# EAGLE design Pre_sch (EAGLE 9.6.2)
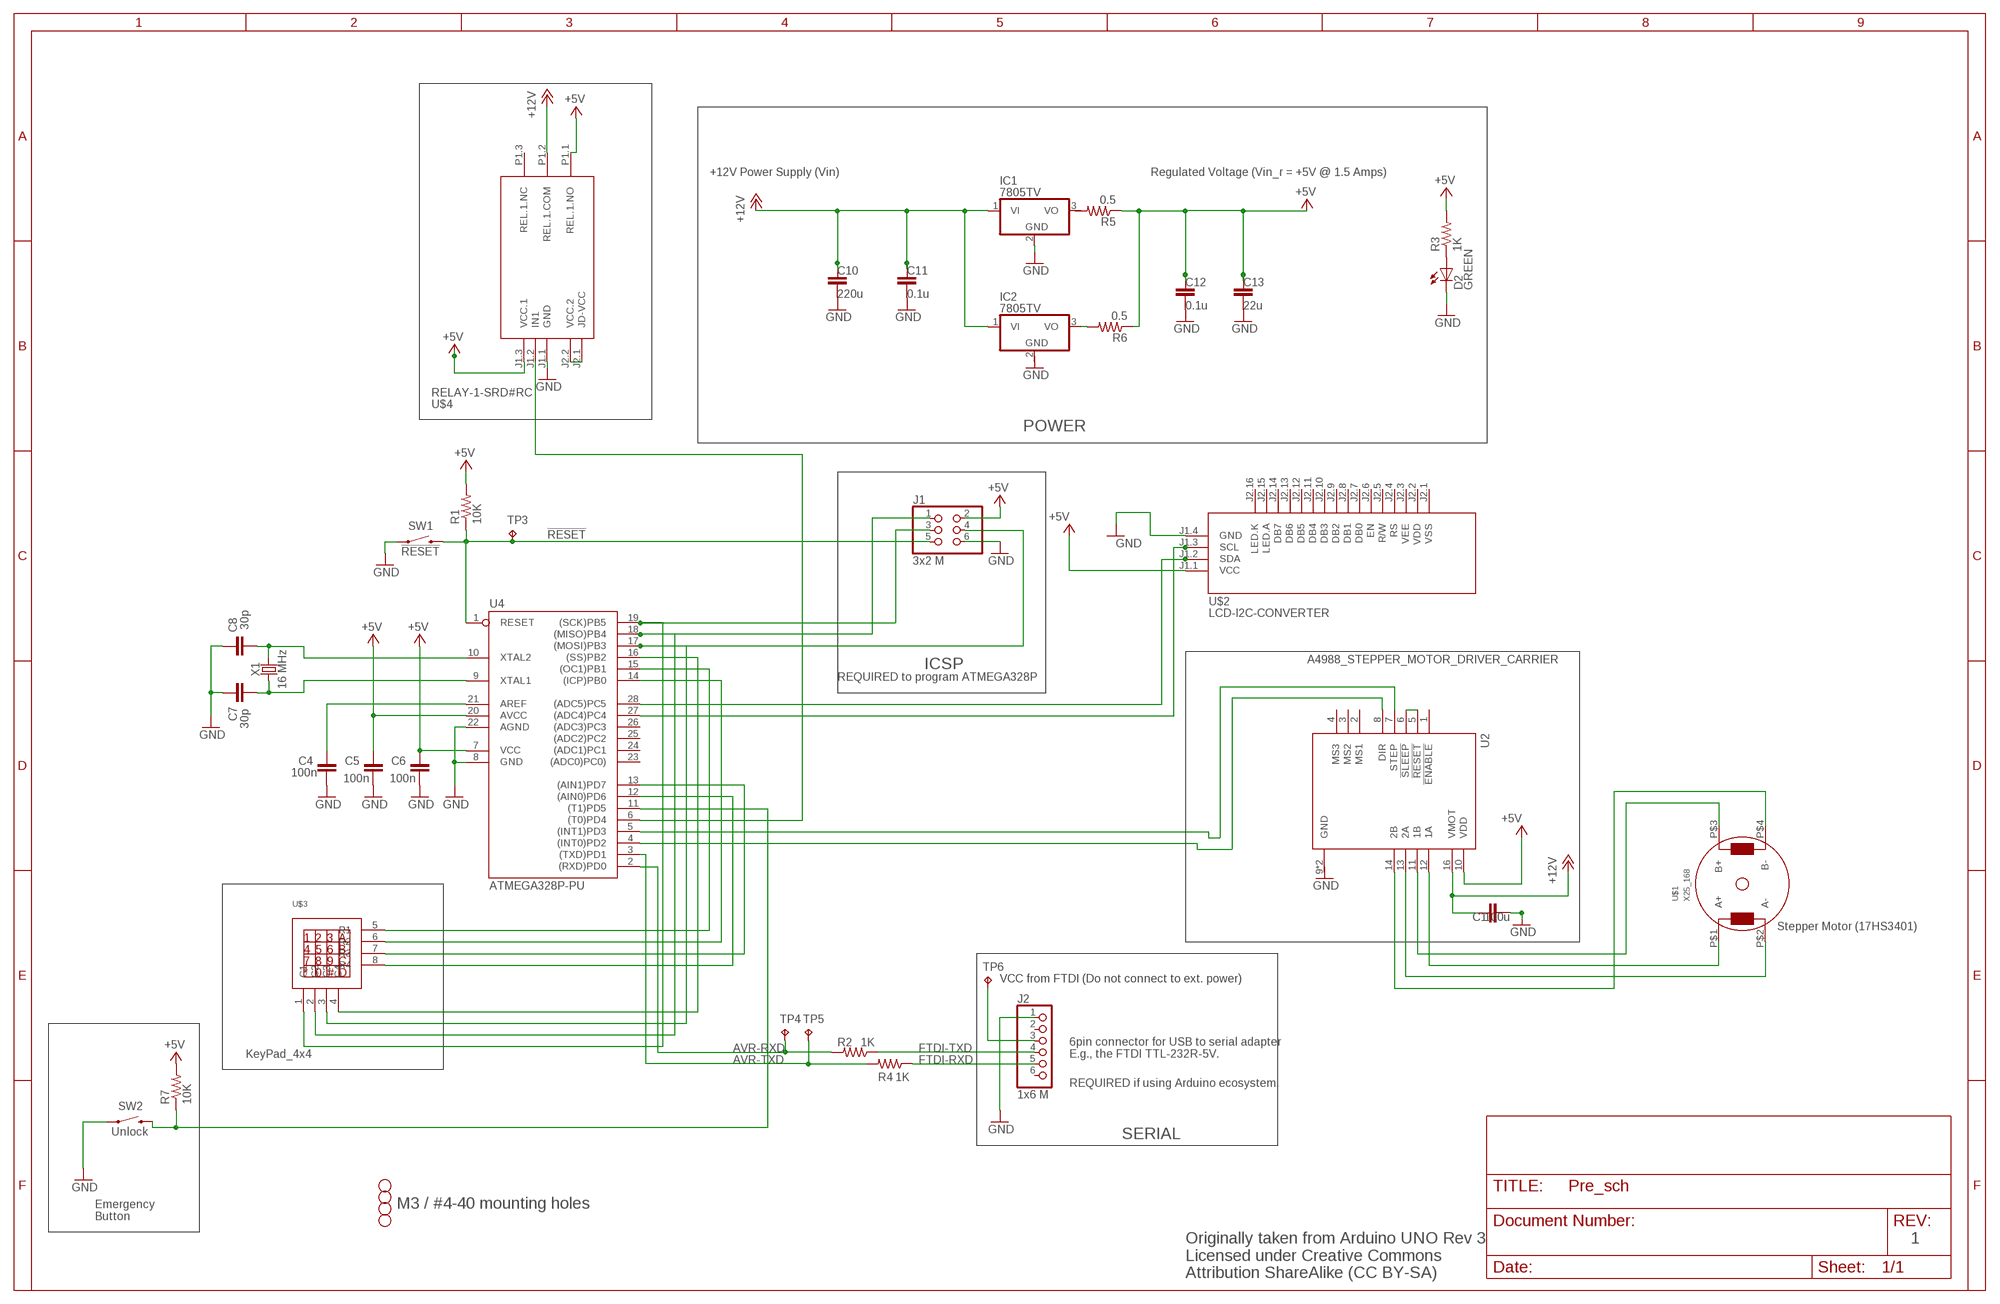
[diagram p0: schematic, sheet 1]

## Parts
C1  100u  C-EUC0805K  [C0805K]
C4  100n  C-EUC0805K  [C0805K]
C5  100n  C-EUC0805K  [C0805K]
C6  100n  C-EUC0805K  [C0805K]
C7  30p  C-EUC0805K  [C0805K]
C8  30p  C-EUC0805K  [C0805K]
C10  220u  C-EUC0805K  [C0805K]
C11  0.1u  C-EUC0805K  [C0805K]
C12  0.1u  C-EUC0805K  [C0805K]
C13  22u  C-EUC0805K  [C0805K]
D2  GREEN  LEDCHIP-LED0805  [CHIP-LED0805]
H1  STAND-OFF  [STAND-OFF]
H2  STAND-OFF  [STAND-OFF]
H3  STAND-OFF  [STAND-OFF]
H4  STAND-OFF  [STAND-OFF]
IC1  7805TV  [TO220V]
IC2  7805TV  [TO220V]
J1  3x2 M  PINHD-2X3  [2X03]
J2  1x6 M  PINHD-1X6  [1X06]
R1  10K  R-US_R0805  [R0805]
R2  1K  R-US_R0805  [R0805]
R3  1K  R-US_R0805  [R0805]
R4  1K  R-US_R0805  [R0805]
R5  0.5  R-US_R0805  [R0805]
R6  0.5  R-US_R0805  [R0805]
R7  10K  R-US_R0805  [R0805]
SW1  !RESET  SWITCH-MOMENTARY-2SMD  [TACTILE_SWITCH_SMD]
SW2  Unlock  SWITCH-MOMENTARY-2SMD  [TACTILE_SWITCH_SMD]
TP3  TPPAD1-13  [P1-13]
TP4  TPPAD1-13  [P1-13]
TP5  TPPAD1-13  [P1-13]
TP6  TPPAD1-13  [P1-13]
U2  A4988_STEPPER_MOTOR_DRIVER_CARRIER  [MODULE_A4988_STEPPER_MOTOR_DRIVER_CARRIER]
U4  ATMEGA328P-PU  [DIL28-3]
U$1  X25_168  [X25_168]
U$2  LCD-I2C-CONVERTER  [LCD-I2C-CONVERTER]
U$3  KEYPAD4X4  [KEYPAD4X4]
U$4  RELAY-1-SRD#RC  [RELAY-1-SRD#RC]
X1  16 MHz  CRYSTALSMD-HC49UP  [HC49UP]

## Nets
!RESET: J1.5 R1.1 SW1.3 TP3.TP U4.1(RESET)
+5V: C5.2 C6.2 C12.2 C13.2 J1.2 R1.2 R3.2 R5.1 R6.1 R7.2 U2.10(VDD) U4.7(VCC) U4.20(AVCC) U$2.J1.1(VCC) U$4.J1.3(VCC.1) U$4.P1.1(REL.1.NO)
+12V: C1.2 C10.2 C11.2 IC1.1(VI) IC2.1(VI) U2.16(VMOT) U$4.P1.2(REL.1.COM)
AVR-RXD: R2.2 TP4.TP U4.2((RXD)PD0)
AVR-TXD: R4.2 TP5.TP U4.3((TXD)PD1)
FTDI-RXD: J2.5 R4.1
FTDI-TXD: J2.4 R2.1
GND: C1.1 C4.1 C5.1 C6.1 C7.2 C8.2 C10.1 C11.1 C12.1 C13.1 D2.C IC1.2(GND) J1.6 J2.1 SW1.1 SW2.1 U4.8(GND) U4.22(AGND) U$2.J1.4(GND) U$4.J1.1(GND)
MISO: J1.1 U4.18((MISO)PB4) U$3.2(C2)
MOSI: J1.4 U4.17((MOSI)PB3) U$3.3(C3)
N$1: C4.2 U4.21(AREF)
N$2: U2.8(DIR) U4.4((INT0)PD2)
N$3: D2.A R3.1
N$4: U2.7(STEP) U4.5((INT1)PD3)
N$5: J2.3 TP6.TP
N$6: U4.27((ADC4)PC4) U$2.J1.3(SCL)
N$7: U2.5(!RESET) U2.6(!SLEEP)
N$8: U2.11(1B) U$1.P$3(B+)
N$9: U2.12(1A) U$1.P$1(A+)
N$10: U2.13(2A) U$1.P$2(A-)
N$11: U2.14(2B) U$1.P$4(B-)
N$12: U4.28((ADC5)PC5) U$2.J1.2(SDA)
N$13: IC2.3(VO) R6.2
N$14: U4.12((AIN0)PD6) U$3.8(R4)
N$15: U4.13((AIN1)PD7) U$3.7(R3)
N$16: U4.14((ICP)PB0) U$3.6(R2)
N$17: U4.15((OC1)PB1) U$3.5(R1)
N$18: U4.16((SS)PB2) U$3.4(C4)
N$19: U$4.J2.1(JD-VCC) U$4.J2.2(VCC.2)
N$20: U4.6((T0)PD4) U$4.J1.2(IN1)
N$21: R7.1 SW2.3 U4.11((T1)PD5)
SCK: J1.3 U4.19((SCK)PB5) U$3.1(C1)
XTAL1: C7.1 U4.9(XTAL1) X1.1
XTAL2: C8.1 U4.10(XTAL2) X1.2
Unconnected: IC1.3(VO) IC2.2(GND) J2.2 J2.6 R5.2 U2.1(!ENABLE) U2.2(MS1) U2.3(MS2) U2.4(MS3) U4.23((ADC0)PC0)) U4.24((ADC1)PC1) U4.25((ADC2)PC2) U4.26((ADC3)PC3) U$2.J2.1(VSS) U$2.J2.2(VDD) U$2.J2.3(VEE) U$2.J2.4(RS) U$2.J2.5(R/W) U$2.J2.6(EN) U$2.J2.7(DB0) U$2.J2.8(DB1) U$2.J2.9(DB2) U$2.J2.10(DB3) U$2.J2.11(DB4) U$2.J2.12(DB5) U$2.J2.13(DB6) U$2.J2.14(DB7) U$2.J2.15(LED.A) U$2.J2.16(LED.K) U$4.P1.3(REL.1.NC)

## Notes on the sheet
- +12V Power Supply (Vin) | Regulated Voltage (Vin_r = +5V @ 1.5 Amps)
- POWER
- ICSP
- REQUIRED to program ATMEGA328P
- Stepper Motor (17HS3401)
- VCC from FTDI (Do not connect to ext. power)
- KeyPad_4x4
- 6pin connector for USB to serial adapter
  E.g., the FTDI TTL-232R-5V.
- REQUIRED if using Arduino ecosystem.
- SERIAL
- M3 / #4-40 mounting holes
- Emergency
  Button
- 1
- Originally taken from Arduino UNO Rev 3
  Licensed under Creative Commons 
  Attribution ShareAlike (CC BY-SA)

## Power pins joined to a net without a drawn wire
GND: U2.9(GND) U2.15(GND)

## Library data of the parts
C1 C4-C6 C10-C13 = rcl:C-EU: CAPACITOR, European symbol; MFR: Samsung; MPN: CL21B104KBCNNNC; SPICEPREFIX: C
C7 = rcl:C-EU: CAPACITOR, European symbol; DESC: CAP CER 30PF 50V C0G/NP0 0805; MFR: Samsung; MPN: CL21C180JBANNNC; SPICEPREFIX: C
C8 = rcl:C-EU: CAPACITOR, European symbol; DESC: CAP CER 30PF 50V C0G/NP0 0805; MFR: Samsung; MPN: CL21C300JBANNNC; SPICEPREFIX: C
D2 = led:LED: LED OSRAM: - CHIPLED LG R971, LG N971, LY N971, LG Q971, LY Q971, LO R971, LY R971 LH N974, LH R974 LS Q976, LO Q976, LY Q976 LO Q996 - Hyper CHIPLED LW Q18S LB Q993, LB Q99A, LB R99A - SideLED LS A670, LO A670, LY A670, LG A670, LP A670 LB A673, LV A673, LT A673, LW A673 LH A674 LY A675 LS A676, LA A676, LO A676, LY A676, LW A676 LS A679, LY A679, LG A679 - Hyper Micro SIDELED® LS Y876, LA Y876, LO Y876, LY Y876 LT Y87S - SmartLED LW L88C, LW L88S LB L89C, LB L89S, LG L890 LS L89K, LO L89K, LY L89K LS L896, LA L896, LO L896, LY L896 - TOPLED LS T670, LO T670, LY T670, LG T670, LP T670 LSG T670, LSP T670, LSY T670, LOP T670, LYG T670 LG T671, LOG T671, LSG T671 LB T673, LV T673, LT T673, LW T673 LH T674 LS T676, LA T676, LO T676, LY T676, LB T676, LH T676, LSB T676, LW T676 LB T67C, LV T67C, LT T67C, LS T67K, LO T67K, LY T67K, LW E67C LS E67B, LA E67B, LO E67B, LY E67B, LB E67C, LV E67C, LT E67C LW T67C LS T679, LY T679, LG T679 LS T770, LO T770, LY T770, LG T770, LP T770 LB T773, LV T773, LT T773, LW T773 LH T774 LS E675, LA E675, LY E675, LS T675 LS T776, LA T776, LO T776, LY T776, LB T776 LHGB T686 LT T68C, LB T68C - Hyper Mini TOPLED® LB M676 - Mini TOPLED Santana® LG M470 LS M47K, LO M47K, LY M47K Source: http://www.osram.convergy.de LUXEON: - LUMILED® LXK2-PW12-R00, LXK2-PW12-S00, LXK2-PW14-U00, LXK2-PW14-V00 LXK2-PM12-R00, LXK2-PM12-S00, LXK2-PM14-U00 LXK2-PE12-Q00, LXK2-PE12-R00, LXK2-PE12-S00, LXK2-PE14-T00, LXK2-PE14-U00 LXK2-PB12-K00, LXK2-PB12-L00, LXK2-PB12-M00, LXK2-PB14-N00, LXK2-PB14-P00, LXK2-PB14-Q00 LXK2-PR12-L00, LXK2-PR12-M00, LXK2-PR14-Q00, LXK2-PR14-R00 LXK2-PD12-Q00, LXK2-PD12-R00, LXK2-PD12-S00 LXK2-PH12-R00, LXK2-PH12-S00 LXK2-PL12-P00, LXK2-PL12-Q00, LXK2-PL12-R00 Source: www.luxeon.com KINGBRIGHT: KA-3528ASYC Source: www.kingbright.com; MFR: Würth Elektronik; MPN: 150080GS75000
H1-H4 = SparkFun-Hardware:STAND-OFF: Stand Off Drill holes for mechanically mounting via screws, standoffs, etc. Note: Use the keepout ring to avoid running the screw head into surrounding components. Variant Overviews STAND-OFF - Mechanical footprint for a #4 phillips button head screw. STAND-OFF-TIGHT - Mechanical footprint for a #4 phillips button head screw, Example SparkFun Products Screw - Phillips Head (1/4", 4-40, 10 pack) <https://www.sparkfun.com/products/10453> (PRT-10453) Screw - Phillips Head (1/2", 4-40, 10 pack) <https://www.sparkfun.com/products/10452> (PRT-10452) Screw - Phillips Head (3/4", 4-40, 10 pack) <https://www.sparkfun.com/products/10451> (PRT-10451) Screw - Phillips Head (1", 4-40, 10 pack) <https://www.sparkfun.com/products/10450> (PRT-10450)
IC1 IC2 = linear:78*: Positive VOLTAGE REGULATOR Source: http://cache.national.com/ds/LM/LM78L05.pdf http://www.fairchildsemi.com/ds/LM/LM7805.pdf
J1 = SmartPrj:PINHD-2X3: PIN HEADER; MFR: Harwin; MPN: M20-9980345
J2 = pinhead:PINHD-1X6: PIN HEADER; MFR: Sullins; MPN: PRPC006SAAN-RC
R1 R7 = rcl:R-US_: RESISTOR, American symbol; MFR: Yageo; MPN: RC0805FR-0710KL; SPICEPREFIX: R
R2-R6 = rcl:R-US_: RESISTOR, American symbol; MFR: Yageo; MPN: RC0805FR-071KL; SPICEPREFIX: R
SW1 SW2 = SparkFun-Electromechanical:SWITCH-MOMENTARY-2: Various NO switches- pushbuttons, reed, etc; DESC: SWITCH TACTILE SPST-NO 0.05A 12V; MFR: C&K; MPN: RS-187R05A2-DS MT RT
TP3-TP6 = testpad:TP: Test pad
U2 = A4988_STEPPER_MOTOR_DRIVER_CARRIER:A4988_STEPPER_MOTOR_DRIVER_CARRIER: Stepper motor controler; IC: A4988; 1A; Uin mot: 8÷35V; AVAILABILITY: Unavailable; DESCRIPTION: Stepper Motor Driver; MF: Pololu; MP: A4988 STEPPER MOTOR DRIVER CARRIER; PACKAGE: None; PRICE: None
U4 = SmartPrj:ATMEGA328P-: MICROCONTROLLER 4 Kbytes FLASH 128 bytes SRAM 256 bytes EEPROM UART 6-channel 10 bit ADC; MFR: Microchip; MPN: ATMEGA328P-PU
U$1 = x25_168:X25_168: X25168 - Miniature stepper motor for analog gauge
U$2 = diy-modules:LCD-I2C-CONVERTER: I2C Bus to 4-Bit Parallel LCD Interface with LED backlight driver
U$3 = keypad_4x4_raw:KEYPAD4X4
U$4 = diy-modules:RELAY-1-SRD#RC: 1-Channel Relay Module based on SRD-05VDC-SL-C relays Symbol with relays pins Click here to find device on ebay.com <http://www.ebay.com/sch/one+channel+isolated+relay+5v>
X1 = SparkFun-Clocks:CRYSTAL: Crystals (Generic) These are passive quartz crystals, which can be used as a clock source for a microcontroller. Crystal's are two-terminal devices. They require external "load" capacitors to generate an oscillating signal.; DESC: CRYSTAL 16.000 MHZ 18PF SMD; MFR: ECS; MPN: ECS-160-18-5PX-TR

## Net classes
0 default: width 0.254 mm, clearance 0.254 mm

## Board
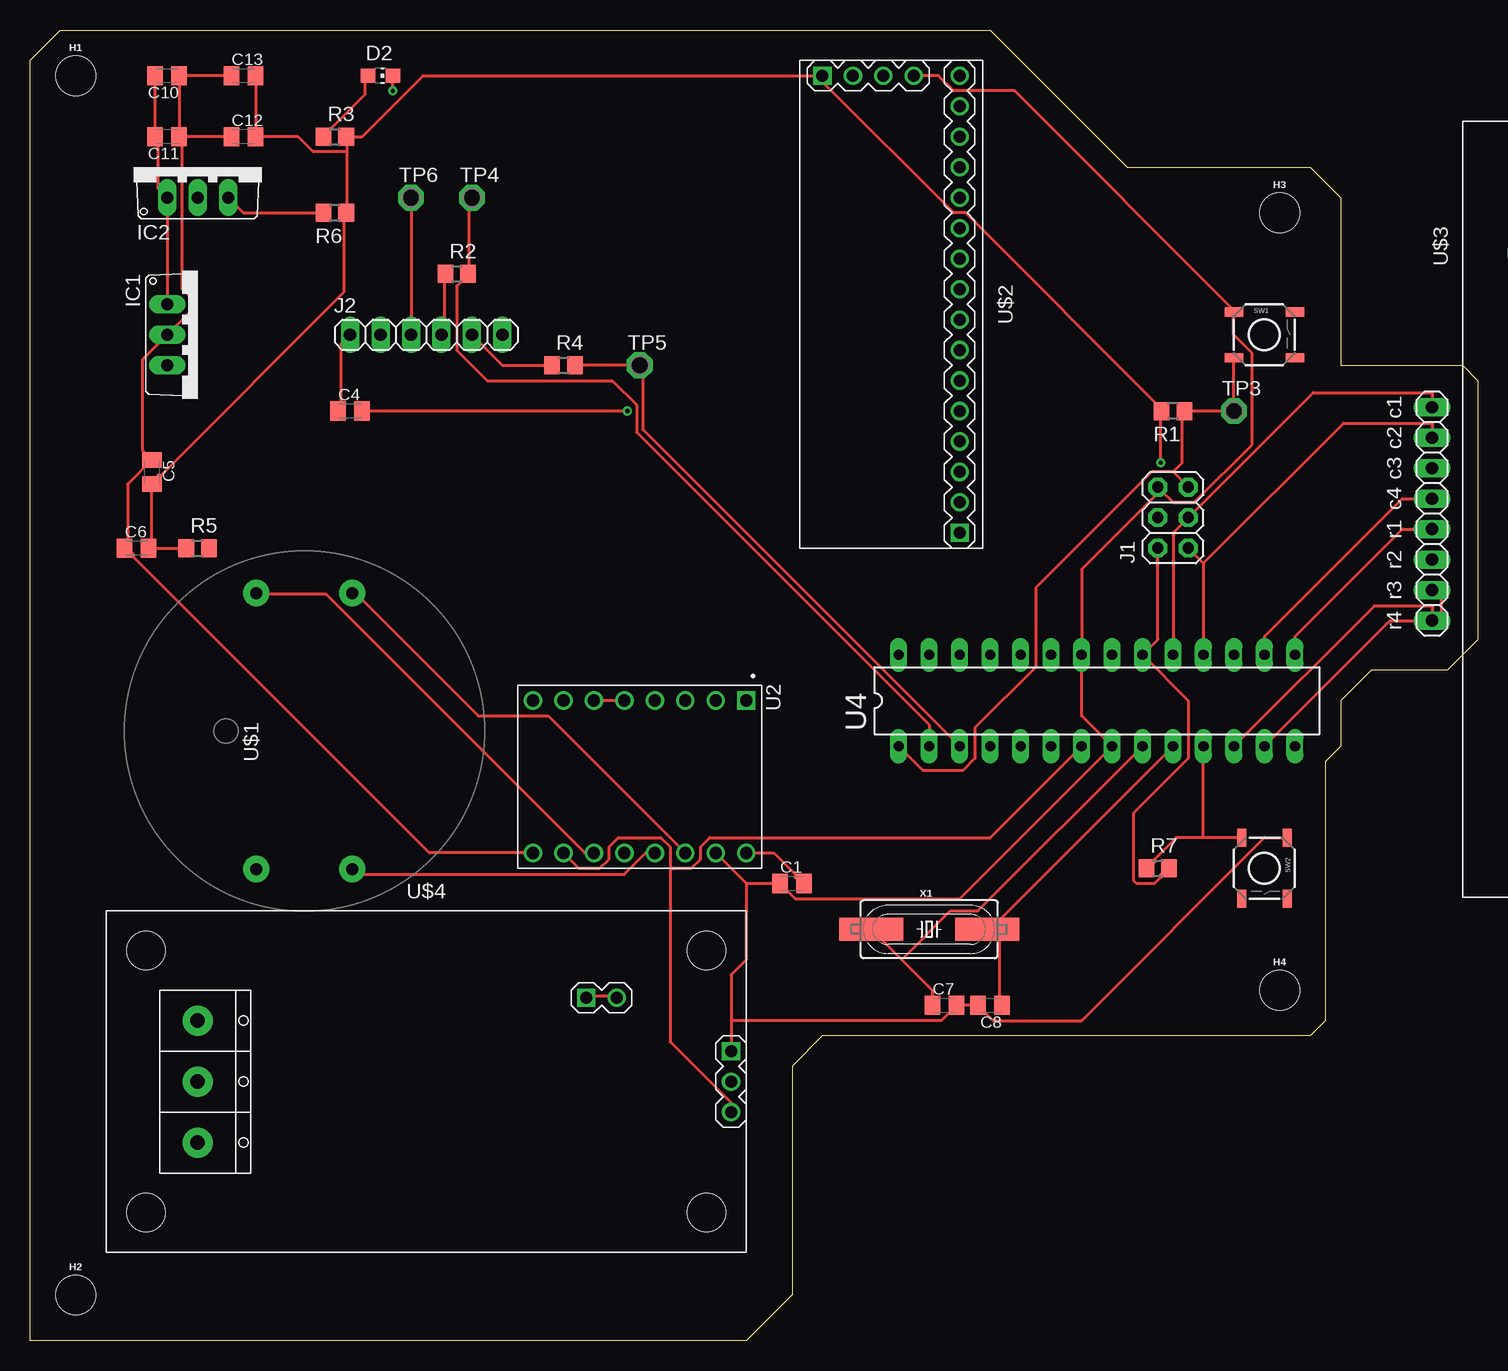
[diagram p1: board, top side]
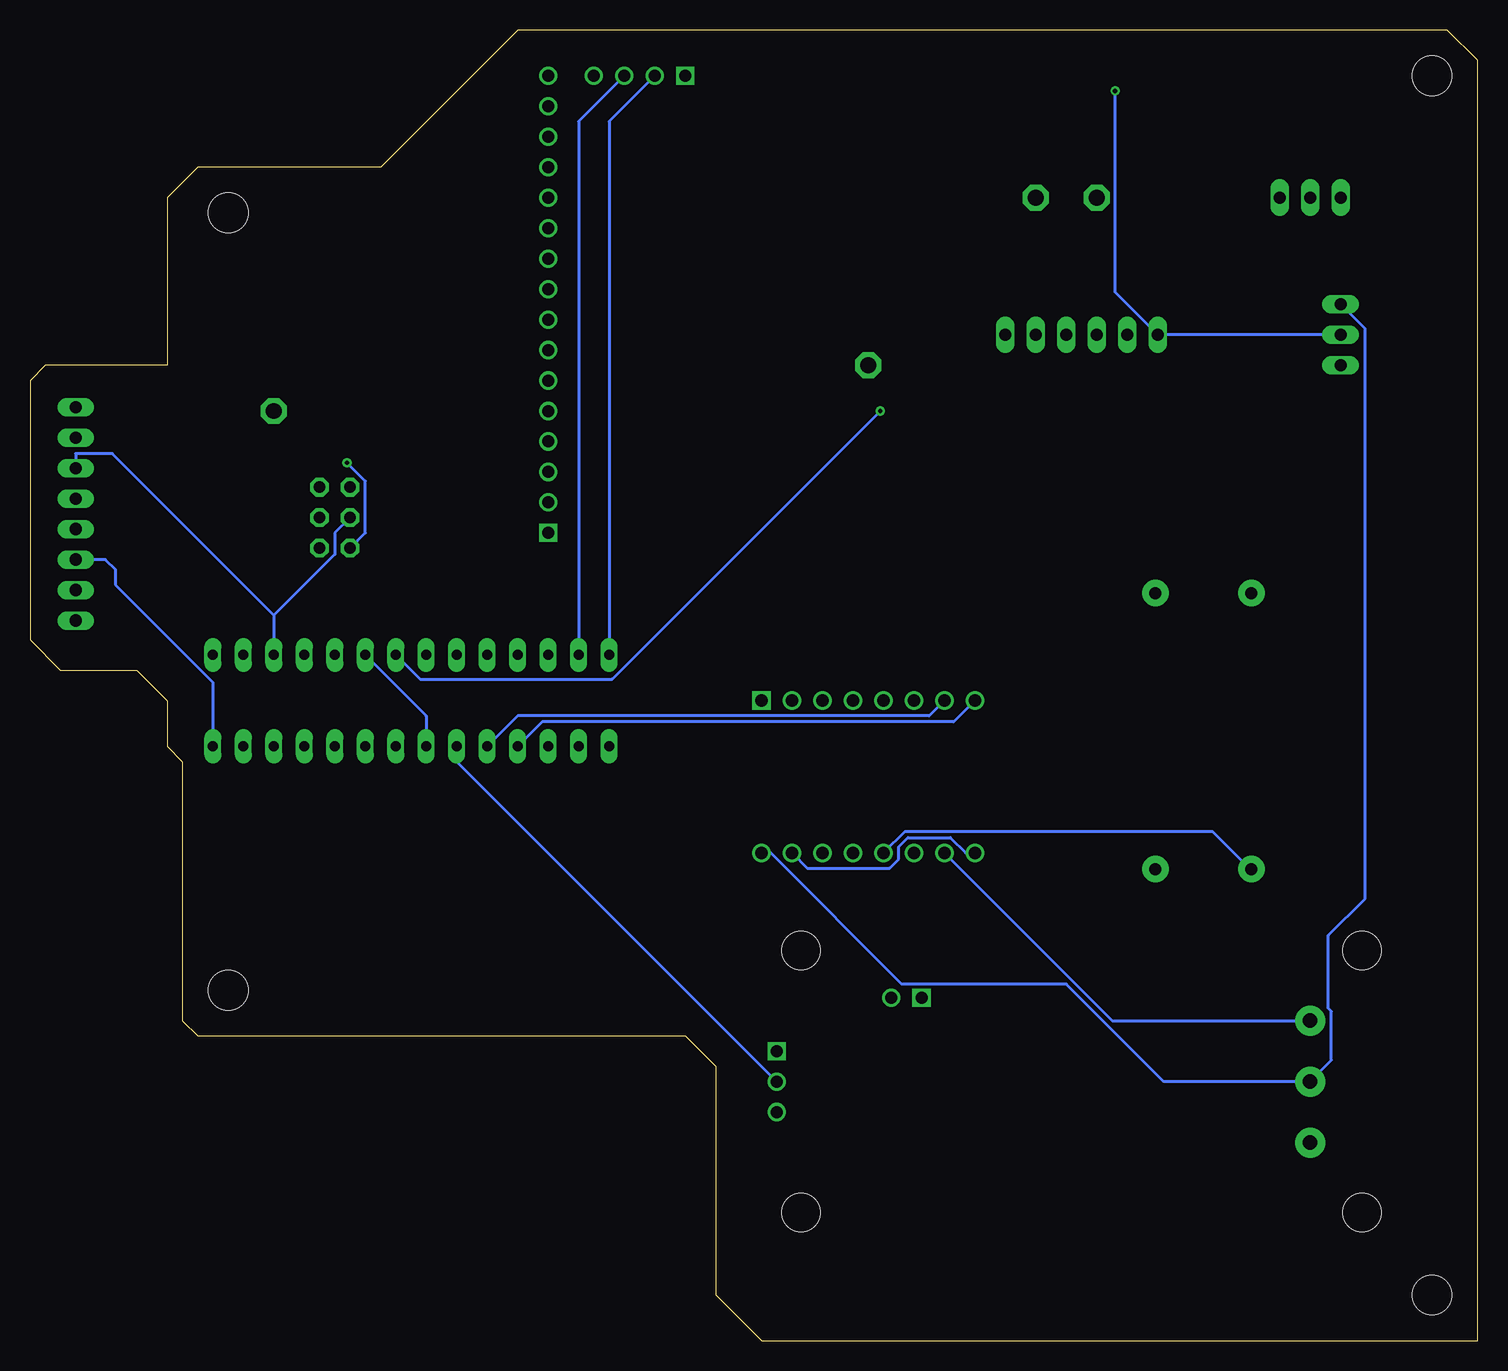
[diagram p2: board, bottom side, seen from below]

Size 120.65 x 109.22 mm. Coordinates in mm from the lower left corner, seen from the top.
Outline: 0,0 0,106.68 2.54,109.22 80.01,109.22 91.44,97.79 106.68,97.79 109.22,95.25 109.22,81.28 119.38,81.28 120.65,80.01 120.65,58.42 118.11,55.88 111.76,55.88 109.22,53.34 109.22,49.53 107.95,48.26 107.95,26.67 106.68,25.4 66.04,25.4 63.5,22.86 63.5,3.81 59.69,0 0,0
Copper layers (1*16): Top 0.035mm / dielectric 1.5mm / Bottom 0.035mm
Design rules "default": minimum track width 6mil, minimum drill 0.35mm, track to track 6mil, track to pad 6mil, pad to pad 6mil, via to via 6mil, smd to smd 6mil, copper to edge 40mil, drill to drill 6mil, minimum pad ring 10mil, minimum via ring 8mil, stop-mask expansion 4mil, vias tented up to drill 0mil, thermal gap 10mil

### Footprints (pad centres in the part's own frame; a part is rotated, then mirrored left to right if it is on the bottom)
C0805K = smd 1.3 x 1.6: 1 -1,0; 2 1,0
CHIP-LED0805 = smd 1.2 x 1.2: A 0,-1.05; C 0,1.05
STAND-OFF = hole 3.302: 0,0
TO220V = drill 1.016 long: 1 -2.54,-2.54; 2 0,-2.54; 3 2.54,-2.54
2X03 = drill 0.95 pad 1.55 octagon: 1 -2.54,-1.27; 2 -2.54,1.27; 3 0,-1.27; 4 0,1.27; 5 2.54,-1.27; 6 2.54,1.27
1X06 = drill 1.016 long: 1 -6.35,0; 2 -3.81,0; 3 -1.27,0; 4 1.27,0; 5 3.81,0; 6 6.35,0
R0805 = smd 1.3 x 1.5: 1 -0.95,0; 2 0.95,0
TACTILE_SWITCH_SMD = smd 1.524 x 0.762: 1 -2.54,1.905; 2 2.54,1.905; 3 -2.54,-1.905; 4 2.54,-1.905
P1-13 = drill 1.321 pad 2.159 octagon: TP 0,0
MODULE_A4988_STEPPER_MOTOR_DRIVER_CARRIER = drill 1.02 square: 1 -6.35,8.89 | drill 1.02: 2 -6.35,6.35; 3 -6.35,3.81; 4 -6.35,1.27; 5 -6.35,-1.27; 6 -6.35,-3.81; 7 -6.35,-6.35; 8 -6.35,-8.89; 9 6.35,-8.89; 10 6.35,-6.35; 11 6.35,-3.81; 12 6.35,-1.27; 13 6.35,1.27; 14 6.35,3.81; 15 6.35,6.35; 16 6.35,8.89
DIL28-3 = drill 0.85 pad 1.422 long: 1 -16.51,-3.81; 2 -13.97,-3.81; 3 -11.43,-3.81; 4 -8.89,-3.81; 5 -6.35,-3.81; 6 -3.81,-3.81; 7 -1.27,-3.81; 8 1.27,-3.81; 9 3.81,-3.81; 10 6.35,-3.81; 11 8.89,-3.81; 12 11.43,-3.81; 13 13.97,-3.81; 14 16.51,-3.81; 15 16.51,3.81; 16 13.97,3.81; 17 11.43,3.81; 18 8.89,3.81; 19 6.35,3.81; 20 3.81,3.81; 21 1.27,3.81; 22 -1.27,3.81; 23 -3.81,3.81; 24 -6.35,3.81; 25 -8.89,3.81; 26 -11.43,3.81; 27 -13.97,3.81; 28 -16.51,3.81
X25_168 = drill 1 pad 2.184: P$1 -11.5,4; P$2 -11.5,-4; P$3 11.5,4; P$4 11.5,-4
LCD-I2C-CONVERTER = drill 1 square: J1.1 -19.05,-5.08; J2.1 19.05,6.35 | drill 1: J1.2 -19.05,-2.54; J1.3 -19.05,0; J1.4 -19.05,2.54; J2.2 16.51,6.35; J2.3 13.97,6.35; J2.4 11.43,6.35; J2.5 8.89,6.35; J2.6 6.35,6.35; J2.7 3.81,6.35; J2.8 1.27,6.35; J2.9 -1.27,6.35; J2.10 -3.81,6.35; J2.11 -6.35,6.35; J2.12 -8.89,6.35; J2.13 -11.43,6.35; J2.14 -13.97,6.35; J2.15 -16.51,6.35; J2.16 -19.05,6.35
KEYPAD4X4 = drill 1.016 long: 1 23.81,-2.54; 2 26.35,-2.54; 3 28.89,-2.54; 4 31.43,-2.54; 5 33.97,-2.54; 6 36.51,-2.54; 7 39.05,-2.54; 8 41.59,-2.54
RELAY-1-SRD#RC = drill 1 square: J1.1 25.4,2.54; J2.1 13.335,6.985 | drill 1: J1.2 25.4,0; J1.3 25.4,-2.54; J2.2 15.875,6.985 | drill 1.2 pad 2.5: P1.1 -19.05,5.08; P1.2 -19.05,0; P1.3 -19.05,-5.08 | hole 3.2: -23.368,10.922; 23.368,10.922; 23.368,-10.922; -23.368,-10.922
HC49UP = smd 5.334 x 1.93: 1 -4.826,0; 2 4.826,0

### Placement (x,y rotation side)
C1  63.5,38.1 0 top
C4  26.67,77.47 0 top
C5  10.16,72.39 270 top
C6  8.89,66.04 0 top
C7  76.2,27.94 0 top
C8  80.01,27.94 180 top
C10  11.43,105.41 180 top
C11  11.43,100.33 180 top
C12  17.78,100.33 0 top
C13  17.78,105.41 0 top
D2  29.21,105.41 270 top
H1  3.81,105.41 0 top
H2  3.81,3.81 0 top
H3  104.14,93.98 0 top
H4  104.14,29.21 0 top
IC1  13.97,83.82 270 top
IC2  13.97,97.79 0 top
J1  95.25,68.58 90 top
J2  33.02,83.82 0 top
R1  95.25,77.47 180 top
R2  35.56,88.9 0 top
R3  25.4,100.33 0 top
R4  44.45,81.28 0 top
R5  13.97,66.04 0 top
R6  25.4,93.98 180 top
R7  93.98,39.37 0 top
SW1  102.87,83.82 0 top
SW2  102.87,39.37 270 top
TP3  100.33,77.47 0 top
TP4  36.83,95.25 0 top
TP5  50.8,81.28 0 top
TP6  31.75,95.25 0 top
U2  50.8,46.99 270 top
U4  88.9,53.34 0 top
U$1  22.86,50.8 90 top
U$2  71.12,86.36 270 top
U$3  119.38,101.6 270 top
U$4  33.02,21.59 0 top
X1  74.93,34.29 0 top

### Tracks (layer width: path | path; a pad name or v marks a point on that pad's centre or on a via)
!RESET
  Top 0.254: SW1.3 TP3.TP R1.1 96.01,77.47 96.01,73.15 95.25,72.39 | U4.1 74.42,47.5 77.72,47.5 78.74,48.51 78.74,51.05 83.82,56.13 83.82,62.74 93.47,72.39 95.25,72.39 | J1.5 95.25,72.39
+5V  (via drill 0.35)
  Top 0.254: 10.16,66.04 C6.2 9.91,66.04 | 10.16,66.04 R5.1 | 10.16,66.04 C5.2 10.16,71.63 10.67,72.14 10.92,72.14 26.16,87.38 26.16,93.98 R6.1 26.42,93.98 26.42,99.06 | 18.8,100.33 18.8,105.41 C13.2 | 26.42,100.33 26.42,99.06 | 26.42,100.33 27.69,100.33 32.77,105.41 U$2.J1.1 66.04,104.9 76.96,93.98 77.98,93.98 94.49,77.47 R1.2 94.23,77.47 v94.23,73.15 | 26.42,100.33 R3.2 | 18.8,100.33 22.35,100.33 23.62,99.06 26.42,99.06 | 18.8,100.33 C12.2 | R7.2 94.74,39.37 94.23,38.86 94.23,38.61 93.73,38.1 92.2,38.1 91.95,38.35 91.95,43.94 96.52,48.51 96.52,53.34 U4.20 93.98,58.42 J1.2 | U$4.J1.3 58.42,19.81 53.34,24.89 53.34,39.37 | 53.34,39.37 53.34,41.15 52.58,41.91 49.02,41.91 48.26,41.15 48.26,40.13 47.5,39.37 45.72,39.37 U2.10 | U4.7 80.01,41.91 56.64,41.91 55.88,41.15 55.88,40.13 55.12,39.37 53.34,39.37
  Bottom 0.254: v94.23,73.15 92.71,71.63 92.71,67.31 J1.2 | U4.7 87.63,52.07 U4.20 | U$4.P1.1 30.48,26.67 U2.10
+12V
  Top 0.254: C10.2 10.41,105.41 10.41,100.33 C11.2 10.67,100.33 10.67,96.01 IC2.1 IC1.1 | U2.16 61.98,40.64 63.75,38.86 63.75,38.61 64.26,38.1 C1.2
  Bottom 0.254: U2.16 58.93,40.64 48.01,29.72 34.29,29.72 26.16,21.59 U$4.P1.2 12.19,23.37 12.19,27.43 12.45,27.69 12.45,33.78 9.4,36.83 9.4,84.33 IC1.1
AVR-RXD
  Top 0.254: 36.58,88.9 36.58,95 TP4.TP | U4.2 74.93,51.31 50.55,75.69 50.55,77.98 48.51,80.01 38.1,80.01 35.56,82.55 35.56,87.88 36.58,88.9 | 36.58,88.9 R2.2
AVR-TXD
  Top 0.254: R4.2 TP5.TP 51.05,81.03 51.05,75.95 U4.3
FTDI-RXD
  Top 0.254: R4.1 39.37,81.28 J2.5
FTDI-TXD
  Top 0.254: J2.4 34.54,84.07 34.54,88.9 R2.1
GND  (via drill 0.35)
  Top 0.254: 94.23,70.87 95.25,69.85 97.03,69.85 101.85,74.68 101.85,82.3 100.33,83.82 SW1.1 100.33,85.85 82.04,104.14 76.96,104.14 75.69,105.41 U$2.J1.4 | 94.23,70.87 87.63,64.26 U4.22 87.63,52.07 U4.8 77.47,36.83 63.75,36.83 62.48,38.1 | 94.23,70.87 J1.6 | v30.23,104.14 30.23,105.41 D2.C | J2.1 25.91,83.06 25.91,77.47 C4.1 | C12.1 12.7,100.33 | 12.7,100.33 12.45,100.33 | C13.1 12.45,105.41 | 12.45,105.41 12.45,100.33 | 12.45,105.41 C10.1 | 8.13,66.04 8.13,71.37 10.16,73.41 | 10.16,73.41 9.4,74.17 9.4,81.79 IC1.2 13.46,85.85 13.46,86.87 12.7,87.63 12.7,100.33 | 10.16,73.41 C5.1 | 12.45,100.33 C11.1 | 59.69,38.1 62.48,38.1 | U2.15 59.69,38.1 | 58.42,26.67 58.42,30.48 59.69,31.75 59.69,38.1 | 58.42,26.67 U$4.J1.1 | SW2.1 102.87,41.91 87.63,26.67 80.26,26.67 78.99,27.94 | 78.99,27.94 77.22,27.94 | 78.99,27.94 C8.2 | 58.42,26.67 75.95,26.67 77.22,27.94 | 77.22,27.94 C7.2 | 8.13,66.04 8.64,65.53 8.64,65.28 33.27,40.64 U2.9 | 8.13,66.04 C6.1 | 62.48,38.1 C1.1
  Bottom 0.254: v30.23,104.14 30.23,87.38 J2.1 IC1.2 | U2.9 42.67,40.64 43.94,41.91 47.5,41.91 48.26,41.15 48.26,40.13 49.02,39.37 55.88,39.37 U2.15
MISO
  Top 0.254: 97.79,64.77 U4.18 | J1.1 97.79,64.77 | 97.79,64.77 109.47,76.45 116.84,76.45 U$3.2
MOSI
  Bottom 0.254: 100.33,60.45 U4.17 | 100.33,60.45 95.25,65.53 95.25,67.31 J1.4 | 100.33,60.45 113.79,73.91 116.84,73.91 U$3.3
N$1  (via drill 0.35)
  Top 0.254: v49.78,77.47 C4.2
  Bottom 0.254: v49.78,77.47 72.14,55.12 88.14,55.12 U4.21
N$2
  Bottom 0.254: U4.4 77.98,51.56 43.69,51.56 U2.8
N$3
  Top 0.254: D2.A 27.94,105.41 27.94,103.89 24.38,100.33 R3.1
N$4
  Bottom 0.254: U4.5 80.01,52.07 45.72,52.07 U2.7
N$5
  Top 0.254: TP6.TP J2.3
N$6
  Bottom 0.254: U4.27 74.93,101.6 U$2.J1.3
N$7
  Top 0.254: U2.5 U2.6
N$8
  Top 0.254: U2.11 46.23,40.64 24.64,62.23 19.05,62.23 U$1.P$3
N$9
  Bottom 0.254: U2.12 47.75,42.42 22.1,42.42 19.05,39.37 U$1.P$1
N$10
  Top 0.254: U2.13 51.31,40.64 49.53,38.86 27.18,38.86 26.92,39.12 U$1.P$2
N$11
  Top 0.254: U2.14 43.18,52.07 37.34,52.07 26.92,62.48 U$1.P$4
N$12
  Bottom 0.254: U4.28 72.39,101.6 U$2.J1.2
N$13
  Top 0.254: R6.2 17.78,93.98 IC2.3
N$14
  Top 0.254: U4.12 112.01,61.21 116.84,61.21 U$3.8
N$15
  Top 0.254: U4.13 113.28,59.94 116.84,59.94 117.6,60.71 117.6,61.72 116.84,62.48 U$3.7
N$16
  Bottom 0.254: U4.14 105.41,54.86 113.54,62.99 113.54,64.26 114.37,65.09 U$3.6
N$17
  Top 0.254: U4.15 105.41,58.67 114.37,67.63 U$3.5
N$18
  Top 0.254: U4.16 102.87,58.67 114.37,70.17 U$3.4
N$19
  Top 0.254: U$4.J2.1 46.48,28.7 48.77,28.7 U$4.J2.2
N$20
  Bottom 0.254: U4.6 85.09,48.26 U$4.J1.2
N$21
  Top 0.254: SW2.3 97.79,41.91 | 97.79,41.91 95.5,41.91 93.73,40.13 93.73,39.88 93.22,39.37 R7.1 | 97.79,41.91 U4.11
SCK
  Top 0.254: U4.19 95.25,67.31 J1.3 106.93,78.99 116.84,78.99 U$3.1
XTAL1
  Top 0.254: X1.1 72.64,31.75 | 72.64,31.75 75.18,29.21 75.18,27.94 C7.1 | U4.9 78.99,35.81 76.71,35.81 72.64,31.75
XTAL2
  Top 0.254: C8.1 80.77,27.94 80.77,33.27 X1.2 80.01,34.29 U4.10